# EAGLE design booz_imu_v (EAGLE 6.1)
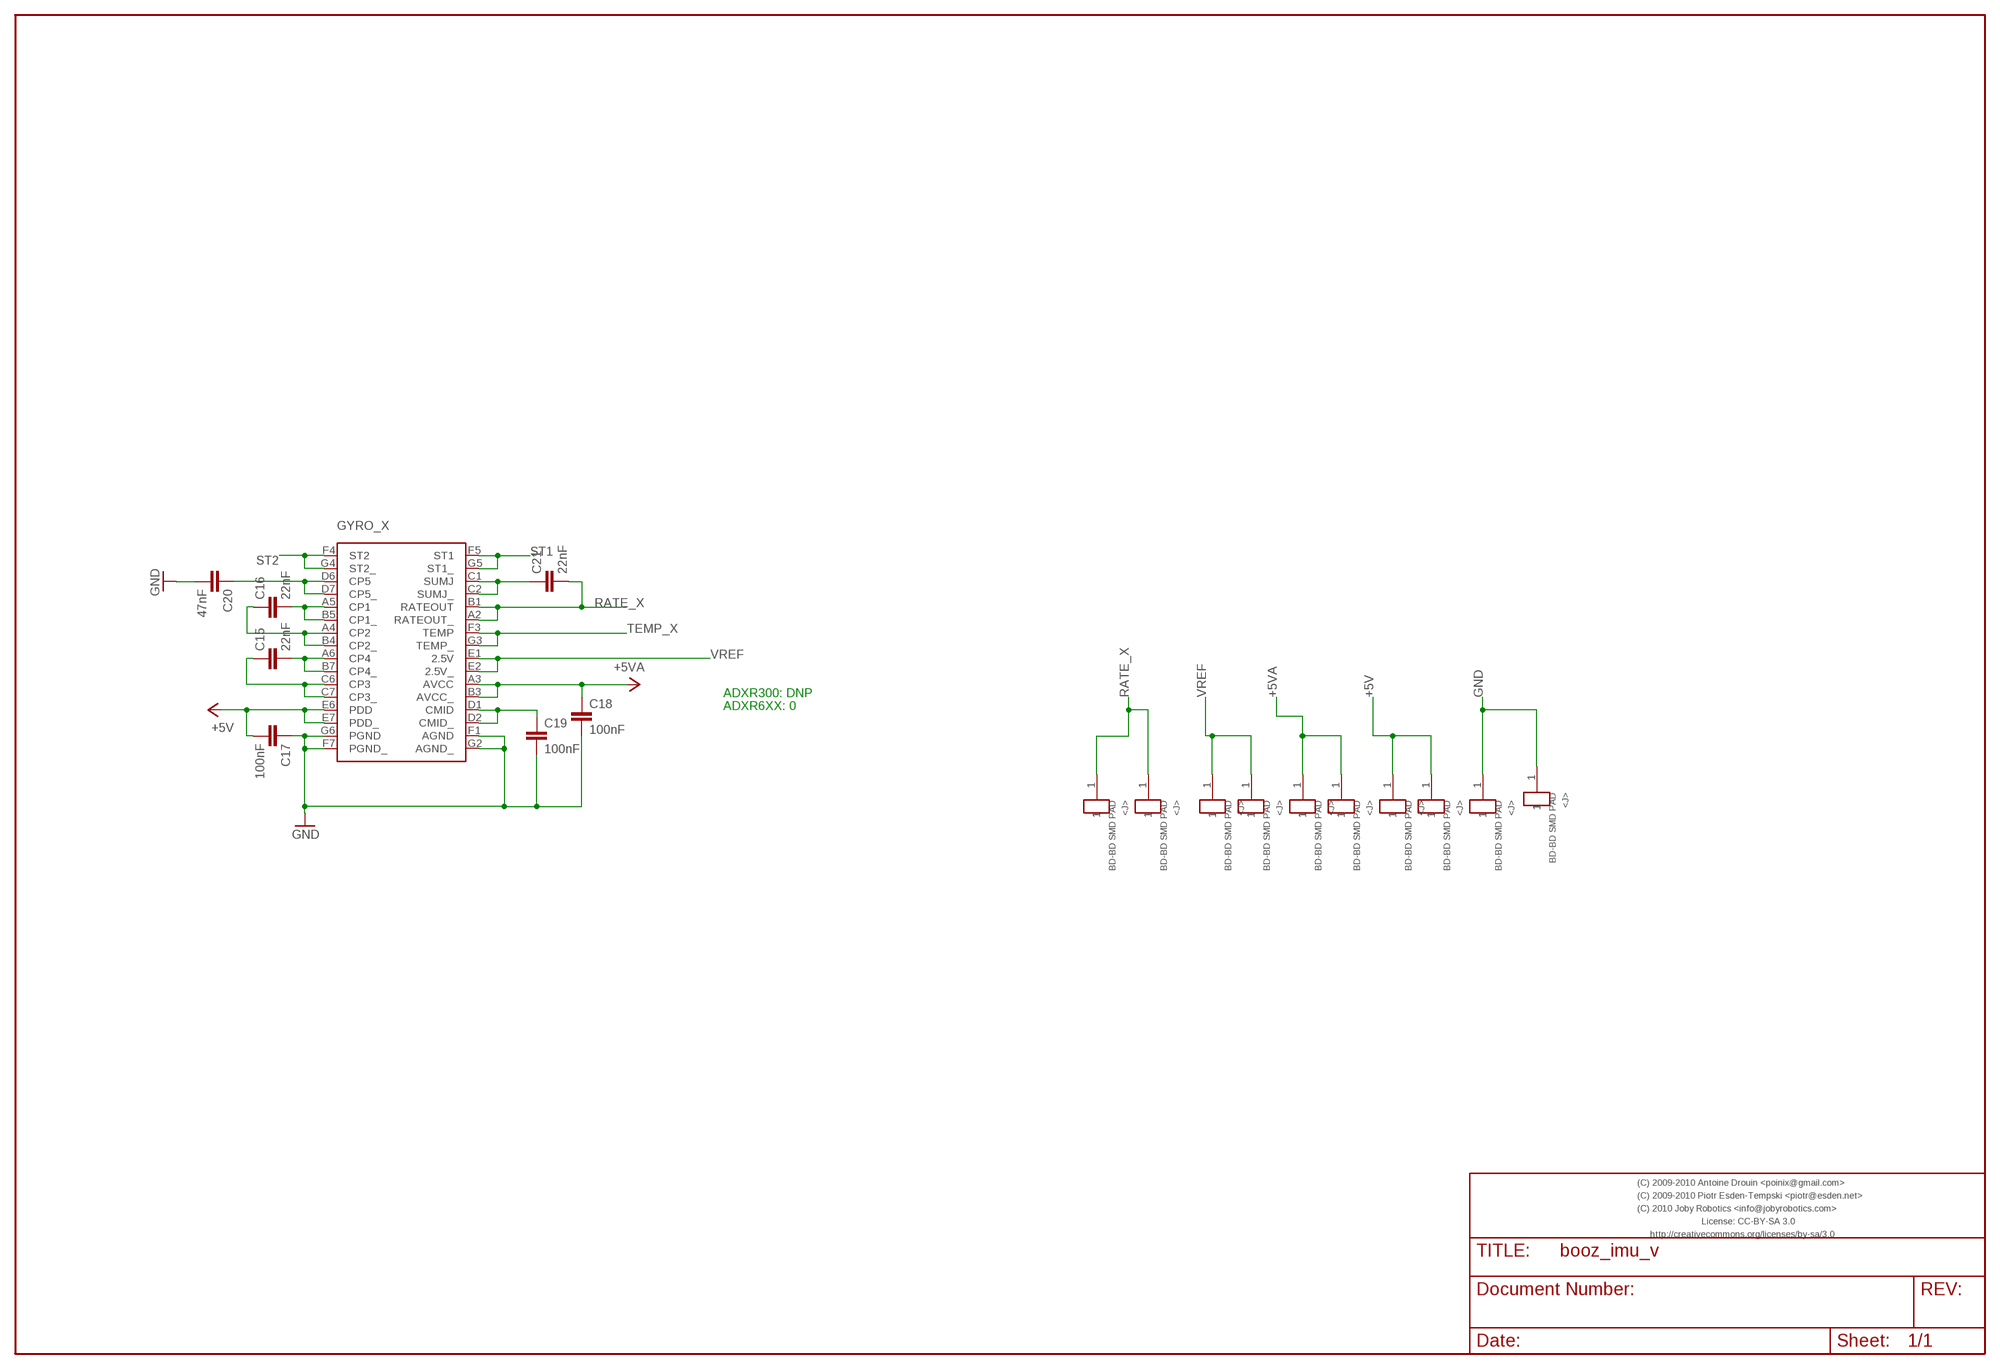
[diagram p0: schematic, sheet 1]

## Parts
C15  22nF  CAPACITOR-0603  [0603-CAP]
C16  22nF  CAPACITOR-0603  [0603-CAP]
C17  100nF  CAPACITOR-0603  [0603-CAP]
C18  100nF  CAPACITOR-0603  [0603-CAP]
C19  100nF  CAPACITOR-0603  [0603-CAP]
C20  47nF  CAPACITOR-0603  [0603-CAP]
C21  22nF  CAPACITOR-0603  [0603-CAP]
GYRO_X  ADXR  [BC-32]
J1  SOLDERPAD25X160  [SOLDERPAD25X160]
J2  SOLDERPAD25X160  [SOLDERPAD25X160]
J3  SOLDERPAD25X160  [SOLDERPAD25X160]
J4  SOLDERPAD25X160  [SOLDERPAD25X160]
J5  SOLDERPAD25X160  [SOLDERPAD25X160]
J6  SOLDERPAD25X160  [SOLDERPAD25X160]
J7  SOLDERPAD25X160  [SOLDERPAD25X160]
J8  SOLDERPAD25X160  [SOLDERPAD25X160]
J9  SOLDERPAD25X160  [SOLDERPAD25X160]
J10  SOLDERPAD25X160  [SOLDERPAD25X160]

## Nets
+5V: C17.P$2 GYRO_X.E6(PDD) GYRO_X.E7(PDD_) J8.1 J9.1
+5VA: C18.P$1 GYRO_X.A3(AVCC) GYRO_X.B3(AVCC_) J6.1 J7.1
GND: C17.P$1 C18.P$2 C19.P$2 C20.P$2 GYRO_X.F1(AGND) GYRO_X.F7(PGND_) GYRO_X.G2(AGND_) GYRO_X.G6(PGND) J2.1 J10.1
N$6: C21.P$1 GYRO_X.C1(SUMJ) GYRO_X.C2(SUMJ_)
N$7: C15.P$1 GYRO_X.C6(CP3) GYRO_X.C7(CP3_)
N$11: C20.P$1 GYRO_X.D6(CP5) GYRO_X.D7(CP5_)
N$12: C16.P$2 GYRO_X.A5(CP1) GYRO_X.B5(CP1_)
N$13: C16.P$1 GYRO_X.A4(CP2) GYRO_X.B4(CP2_)
N$14: C15.P$2 GYRO_X.A6(CP4) GYRO_X.B7(CP4_)
N$19: C19.P$1 GYRO_X.D1(CMID) GYRO_X.D2(CMID_)
RATE_X: C21.P$2 GYRO_X.A2(RATEOUT_) GYRO_X.B1(RATEOUT) J1.1 J3.1
ST1: GYRO_X.F5(ST1) GYRO_X.G5(ST1_)
ST2: GYRO_X.F4(ST2) GYRO_X.G4(ST2_)
TEMP_X: GYRO_X.F3(TEMP) GYRO_X.G3(TEMP_)
VREF: GYRO_X.E1(2.5V) GYRO_X.E2(2.5V_) J4.1 J5.1

## Notes on the sheet
- ADXR300: DNP
- ADXR6XX: 0
- (C) 2009-2010 Antoine Drouin <poinix@gmail.com>
- (C) 2009-2010 Piotr Esden-Tempski <piotr@esden.net>
- (C) 2010 Joby Robotics <info@jobyrobotics.com>
- License: CC-BY-SA 3.0
- http://creativecommons.org/licenses/by-sa/3.0

## Library data of the parts
C15-C21 = pel_dipol_comp:CAPACITOR
GYRO_X = paparazzi:ADXR
J1-J10 = booz_imu_h:SOLDERPAD25X160

## Board
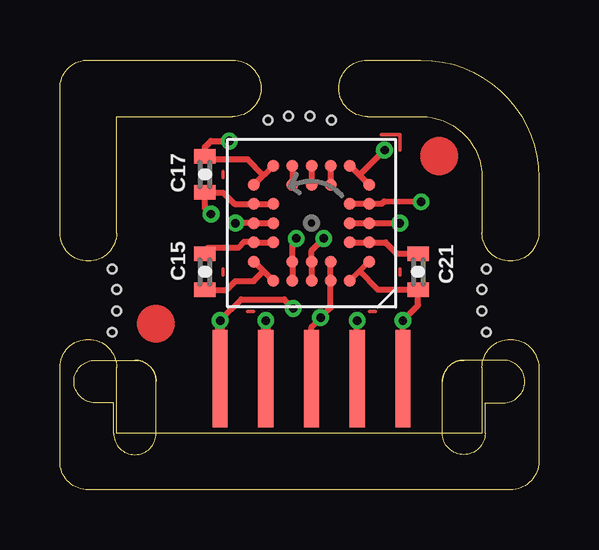
[diagram p1: board, top side]
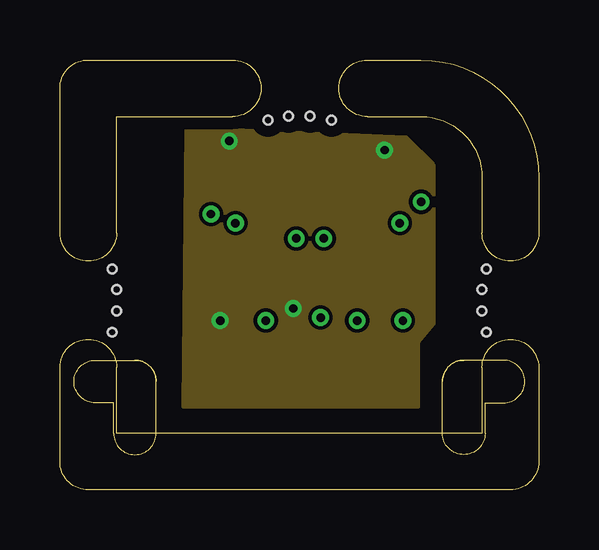
[diagram p2: board, inner layer Route2]
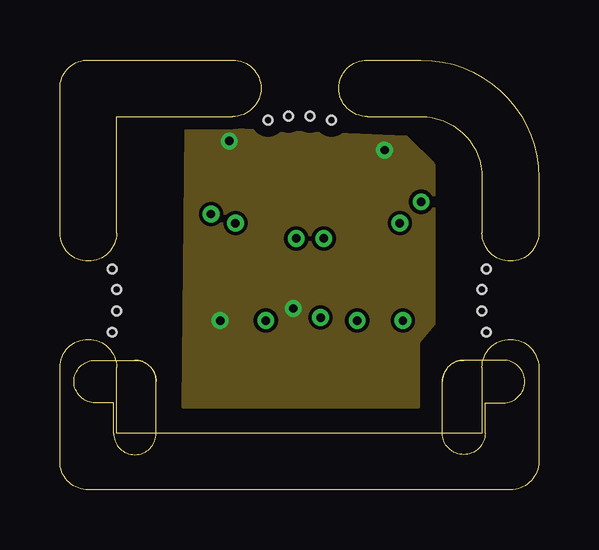
[diagram p3: board, inner layer Route15]
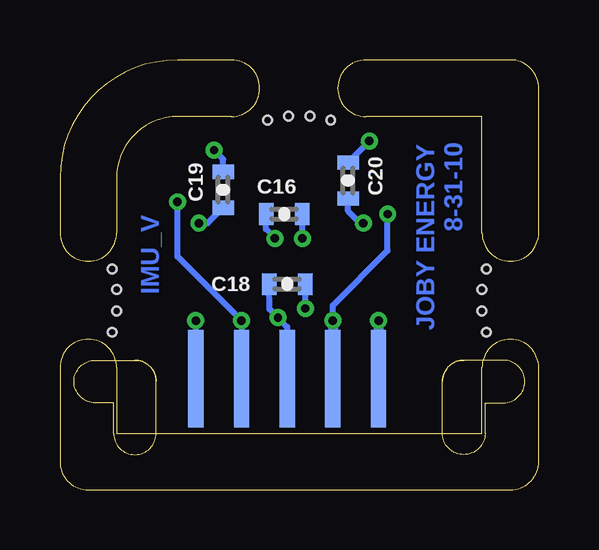
[diagram p4: board, bottom side, seen from below]

Size 19.96 x 17.93 mm. Coordinates in mm from the lower left corner, seen from the top.
Outline: 17.6,2.36 2.36,2.36 2.36,5.11 arc180 0,5.11 0,1.18 arc90 1.18,0 18.78,0 arc90 19.96,1.18 19.96,5.11 arc180 17.6,5.11 17.6,2.36
Outline: 2.36,10.72 2.36,15.57 7.2,15.57 arc180 7.2,17.93 1.18,17.93 arc90 0,16.75 0,10.72 arc180 2.36,10.72
Outline: 12.81,15.57 15.06,15.57 arc-90 17.6,13.03 17.6,10.72 arc180 19.96,10.72 19.96,13.03 arc90 15.06,17.93 12.81,17.93 arc180 12.81,15.57
Copper layers (1*2+15*16): Top 0.035mm / dielectric 0.2mm / Route2 0.035mm / dielectric 1.5mm / Route15 0.035mm / dielectric 0.2mm / Bottom 0.035mm
Design rules: minimum track width 0.15mm, minimum drill 0.35mm, track to track 0.15mm, track to pad 0.15mm, pad to pad 0.15mm, via to via 0.15mm, smd to smd 0.15mm, copper to edge 20mil, drill to drill 8mil, minimum pad ring 0.177mm, minimum via ring 0.177mm, stop-mask expansion 4mil, vias tented up to drill 14mil, thermal gap 10mil
Holes 0.36 mm at 2.36,7.47 2.18,9.22 2.18,6.58 9.54,15.6 8.67,15.42 11.32,15.42 17.6,7.47 17.78,6.58 17.78,9.22 9.54,15.6 10.43,15.6 2.36,8.36 17.6,8.36
Milling: 18 lines

### Footprints (pad centres in the part's own frame; a part is rotated, then mirrored left to right if it is on the bottom)
0603-CAP = smd 0.6 x 0.9: P$1 -0.75,0; P$2 0.75,0
BC-32 = smd 0.5 x 0.5: A2 -1.6,2.4; A3 -0.8,2.4; A4 0,2.4; A5 0.8,2.4; A6 1.6,2.4; B1 -2.4,1.6; B3 -0.8,1.6; B4 0,1.6; B5 0.8,1.6; B7 2.4,1.6; C1 -2.4,0.8; C2 -1.6,0.8; C6 1.6,0.8; C7 2.4,0.8; D1 -2.4,0; D2 -1.6,0; D6 1.6,0; D7 2.4,0; E1 -2.4,-0.8; E2 -1.6,-0.8; E6 1.6,-0.8; E7 2.4,-0.8; F1 -2.4,-1.6; F3 -0.8,-1.6; F4 0,-1.6; F5 0.8,-1.6; F7 2.4,-1.6; G2 -1.6,-2.4; G3 -0.8,-2.4; G4 0,-2.4; G5 0.8,-2.4; G6 1.6,-2.4
SOLDERPAD25X160 = smd 0.635 x 4.064: 1 0,0

### Placement (x,y rotation side)
C15  6.05,9.09 270 top
C16  10.62,11.51 0 bottom
C17  6.05,13.16 270 top
C18  10.49,8.59 0 bottom
C19  13.16,12.52 90 bottom
C20  7.95,12.9 90 bottom
C21  14.94,9.09 270 top
GYRO_X  10.49,11.13 180 top
J1  14.3,4.65 0 bottom
J2  6.68,4.65 0 bottom
J3  14.3,4.65 0 top
J4  12.4,4.65 0 bottom
J5  12.4,4.65 0 top
J6  10.49,4.65 0 bottom
J7  10.49,4.65 0 top
J8  8.59,4.65 0 bottom
J9  8.59,4.65 0 top
J10  6.68,4.65 0 top

### Tracks (layer width: path | path; a pad name or v marks a point on that pad's centre or on a via)
+5V  (via drill 0.35)
  Top 0.254: 8.09,11.9 8.08,11.89 | 8.09,11.9 GYRO_X.E7 7.28,11.93 6.81,12.4 C17.P$2 6.05,11.76 v6.3,11.51 | GYRO_X.E6 8.12,11.93 8.09,11.9
  Top 0.406: J9.1 v8.59,7.06
  Bottom 0.254: v8.59,7.06 8.59,7.7 6.3,9.98 v6.3,11.51
  Bottom 0.406: v8.59,7.06 J9.1
+5VA  (via drill 0.35)
  Top 0.203: 11.27,8.73 11.25,8.71 | GYRO_X.A3 11.27,8.73 | 11.27,8.73 11.29,8.75
  Top 0.254: 11.29,8.75 GYRO_X.B3 | GYRO_X.A3 11.29,7.61 v10.87,7.19 10.49,6.81 J7.1
  Bottom 0.254: C18.P$1 11.23,7.54 v10.87,7.19 10.49,6.81 J7.1
GND  (via drill 0.35)
  Top 0.203: GYRO_X.F7 8.08,12.74 8.08,12.78 8.14,12.78 | GYRO_X.F1 12.9,12.73 | GYRO_X.F1 | GYRO_X.F1
  Top 0.254: 12.49,13.13 GYRO_X.G2 | 12.49,13.13 GYRO_X.F1 | v13.54,14.17 12.49,13.13 | v6.68,7.06 7.57,7.95 9.35,7.95 v9.73,7.57 | 8.46,13.16 7.82,13.79 6.16,13.79 C17.P$1 6.05,14.3 6.3,14.55 v7.06,14.55 | GYRO_X.G6 8.52,13.16 8.46,13.16 | 8.14,12.78 8.46,13.09 8.46,13.16
  Top 0.406: J10.1 v6.68,7.06
  Bottom 0.254: v13.54,14.17 13.16,13.79 C19.P$2 | C20.P$2 7.94,13.67 v7.06,14.55 | C18.P$2 9.73,7.95 v9.73,7.57
  Bottom 0.406: v6.68,7.06 J10.1
  pour Route2: 14.94,6.17 15.57,6.93 15.57,13.54 14.43,14.68 5.28,15.06 5.16,3.51 14.94,3.51
  pour Route15: 5.16,3.51 14.94,3.51 14.94,6.17 15.57,6.93 15.57,13.54 14.43,14.68 5.28,15.06
N$1
  Top 0.152: 13.41,14.81 14.17,14.81 14.17,14.17
N$3
  Top 0.152: 6.81,13.28 6.81,13.03
N$4
  Top 0.152: 6.81,9.22 6.81,8.97
N$5
  Top 0.152: 14.17,8.97 14.17,9.22
N$6
  Top 0.203: GYRO_X.C1 12.9,10.33 12.9,10.36
  Top 0.254: GYRO_X.C2 GYRO_X.C1 13.58,10.33 14.03,9.87 14.81,9.86 C21.P$1
N$7
  Top 0.203: 8.09,10.35 8.08,10.36 | 8.09,10.35 GYRO_X.C7 | 8.09,10.35 8.12,10.33 | C15.P$1 6.17,9.98
  Top 0.254: 8.12,10.33 GYRO_X.C6 | 8.09,10.35 7.68,10.35 7.44,10.11 6.17,10.11 6.05,9.98 C15.P$1
N$8
  Top 0.152: 13.16,7.44 12.9,7.44
N$9
  Top 0.152: 8.08,7.44 7.82,7.44
N$11  (via drill 0.35)
  Top 0.254: GYRO_X.D6 GYRO_X.D7 v7.32,11.13
  Bottom 0.254: C20.P$1 7.95,11.63 7.46,11.14 7.32,11.14 v7.32,11.13
N$12  (via drill 0.35)
  Top 0.203: 9.72,8.73 9.73,8.71 | 9.72,8.73 GYRO_X.A5 | 9.69,8.75 9.72,8.73
  Top 0.254: 9.69,8.75 GYRO_X.B5 9.69,10.33 v9.86,10.49
  Bottom 0.254: C16.P$2 9.86,11 v9.86,10.49
N$13  (via drill 0.35)
  Top 0.203: GYRO_X.A4 10.49,8.71
  Top 0.254: GYRO_X.A4 GYRO_X.B4 10.49,9.98 v11,10.49
  Bottom 0.254: C16.P$1 11.38,10.87 v11,10.49
N$14
  Top 0.203: GYRO_X.B7 8.08,9.51 8.08,9.47 8.14,9.47
  Top 0.254: 8.49,9.13 8.14,9.47 | 8.49,9.13 GYRO_X.A6 | C15.P$2 6.95,8.35 7.32,8.71 8.08,8.71 8.49,9.13
N$19  (via drill 0.35)
  Top 0.203: GYRO_X.D1 12.9,11.13 | v14.17,11.13 14.05,11.13
  Top 0.254: GYRO_X.D2 GYRO_X.D1 v14.17,11.13
  Bottom 0.254: C19.P$1 13.81,11.13 v14.17,11.13
RATE_X  (via drill 0.35)
  Top 0.203: GYRO_X.A2 12.1,8.71 12.14,8.71 12.14,8.78 12.49,9.13 GYRO_X.B1
  Top 0.254: C21.P$2 13.27,8.35 12.49,9.13 | C21.P$2 14.94,8.33 | C21.P$2 14.94,7.7 v14.3,7.06 J3.1
  Bottom 0.254: v14.3,7.06 J3.1
ST1
  Top 0.203: 9.72,13.53 9.73,13.54 | GYRO_X.G5 9.72,13.53 | 9.72,13.53 9.69,13.5
  Top 0.254: 9.69,13.5 GYRO_X.F5
ST2
  Top 0.203: GYRO_X.G4 10.49,13.54
  Top 0.254: GYRO_X.G4 GYRO_X.F4
TEMP_X
  Top 0.203: 11.27,13.53 11.25,13.54 | GYRO_X.G3 11.27,13.53 | 11.27,13.53 11.29,13.5
  Top 0.254: 11.29,13.5 GYRO_X.F3
VREF  (via drill 0.35)
  Top 0.203: GYRO_X.E2 12.05,11.93 12.01,11.89
  Top 0.254: 12.05,11.93 GYRO_X.E1 13.41,11.93 13.53,12.03 v15.06,12.01 | J5.1 v12.4,7.06
  Bottom 0.254: v15.06,12.01 15.06,9.73 v12.4,7.06 J5.1
(copper drawn outside any net)
  shapes: Top circle x2

### Text on the board
Bottom: 8-31-10 | JOBY ENERGY | IMU_V
tDocu: p